# EAGLE design YUJI_VTC (EAGLE 8.0.1)
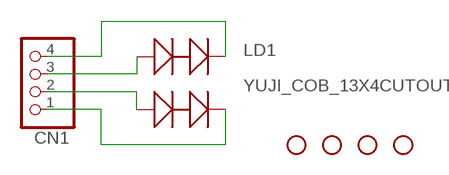
[diagram p0: schematic, sheet 1]

## Parts
CN1  JST_4PIN  [JSTPH4]
LD1  YUJI_COB_13X4CUTOUT  [YUJI_COB_13X4_CUTOUT]
STANDOFF1  STAND-OFF  [STAND-OFF]
STANDOFF2  STAND-OFF  [STAND-OFF]
STANDOFF3  STAND-OFF  [STAND-OFF]
STANDOFF4  STAND-OFF  [STAND-OFF]

## Nets
N$1: CN1.3 LD1.ANODE1
N$2: CN1.4 LD1.CATHODE1
N$3: CN1.1 LD1.CATHODE2
N$4: CN1.2 LD1.ANODE2

## Library data of the parts
CN1 = Yuji_LED:JST_4PIN
LD1 = Yuji_LED:YUJI_COB_13X4
STANDOFF1-STANDOFF4 = Spectron2:STAND-OFF: #4 Stand Off This is the mechanical footprint for a #4 phillips button head screw. Use the keepout ring to avoid running the screw head into surrounding components. SKU : PRT-00447

## Board
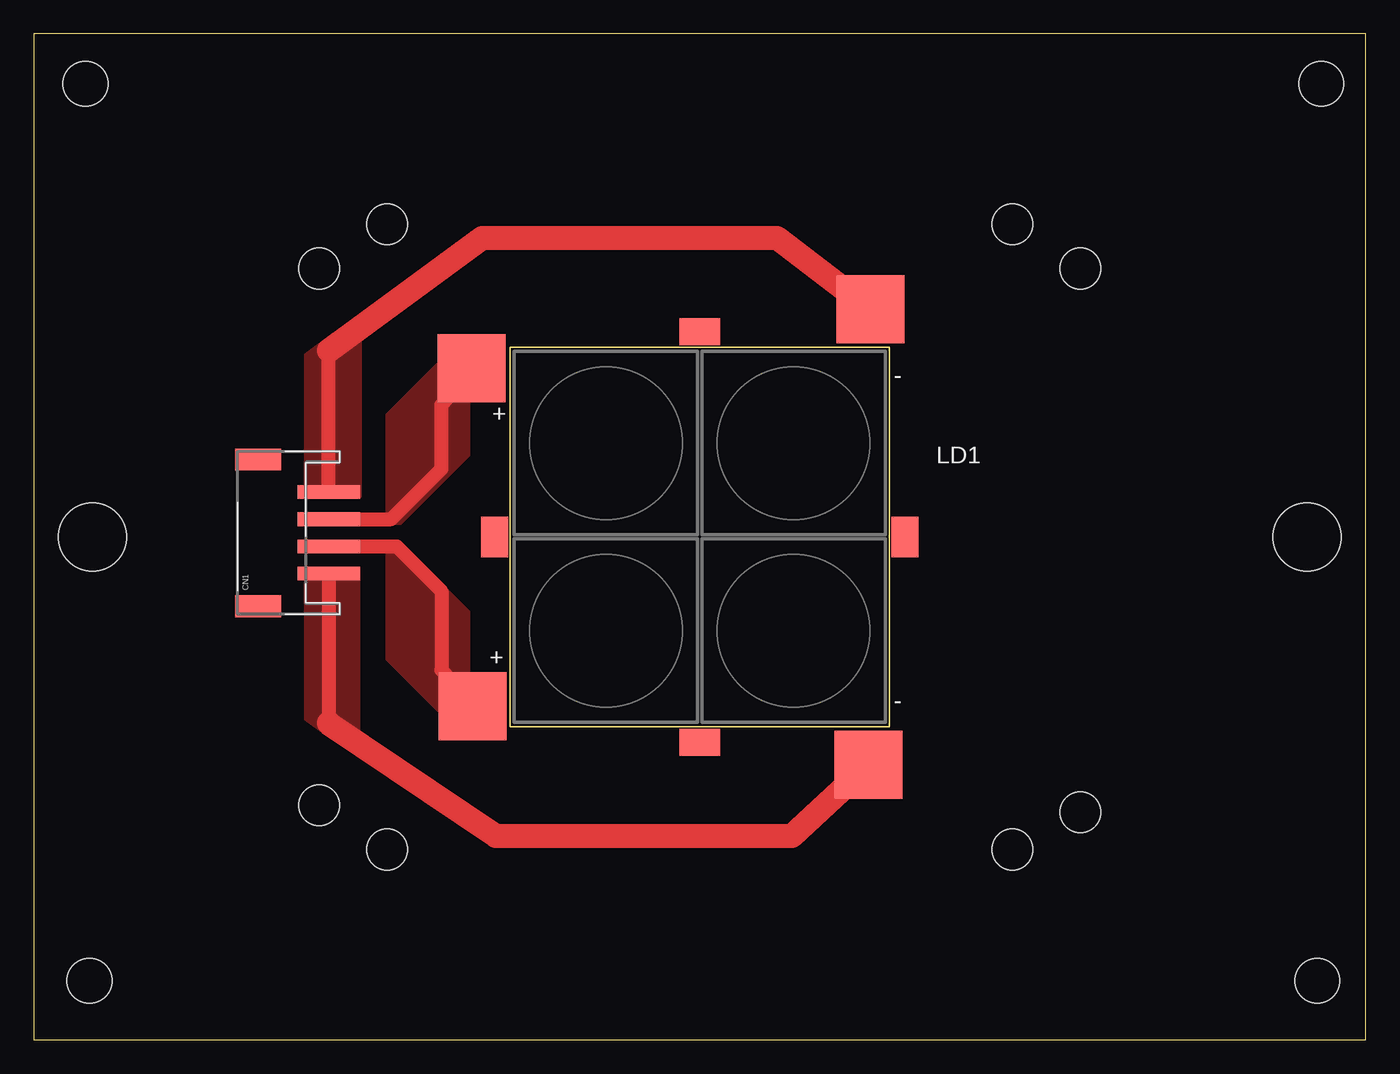
[diagram p1: board, top side]

Size 98 x 74 mm. Coordinates in mm from the lower left corner, seen from the top.
Outline: 0,0 98,0 98,74 0,74 0,0
Copper layers (1*16): Top 0.035559375mm / dielectric 1.6mm / Bottom 0.035559375mm
Design rules "oshpark-2layer": minimum track width 6mil, minimum drill 10mil, track to track 6mil, track to pad 6mil, pad to pad 6mil, via to via 6mil, smd to smd 6mil, copper to edge 15mil, drill to drill 6mil, minimum pad ring 5mil, minimum via ring 5mil, stop-mask expansion 2.5mil, vias tented up to drill 0mil, thermal gap 10mil
Holes 5 mm at 4.3,37 93.7,37
Holes 3 mm at 77,56.75 21,56.75 21,17.25 77,16.75

### Footprints (pad centres in the part's own frame; a part is rotated, then mirrored left to right if it is on the bottom)
JSTPH4 = smd 1 x 4.6: 1 -3,-3.7; 2 -1,-3.7; 3 1,-3.7; 4 3,-3.7 | smd 1.6 x 3.4: NC1 -5.4,1.5; NC2 5.4,1.5
YUJI_COB_13X4_CUTOUT = smd 5 x 5: ANODE1 -16.777,12.412; ANODE2 -16.724,-12.449; CATHODE1 12.571,16.761; CATHODE2 12.417,-16.749 | smd 3 x 2: P$1 0,15.1; P$2 0,-15.1 | smd 2 x 3: P$3 15.1,0; P$4 -15.1,0 | hole 3: -23,23; 23,23; 23,-23; -23,-23
STAND-OFF = hole 3.302: 0,0

### Placement (x,y rotation side)
CN1  18,37.3 90 top
LD1  49,37 0 top
STANDOFF1  3.79,70.34 0 top
STANDOFF2  94.44,4.34 0 top
STANDOFF3  4.09,4.34 0 top
STANDOFF4  94.74,70.34 0 top

### Tracks (layer width: path | path; a pad name or v marks a point on that pad's centre or on a via)
N$1
  Top 1.016: CN1.3 26.3,38.3 30,42 30,46.7 LD1.ANODE1
  pour Top (no thermals): 27,38 32,43 32,50 30,50 26,46 26,38
N$2
  Top 1.016: CN1.4 21.7,50.7
  Top 1.778: 21.7,50.7 33,59 54.68,59 LD1.CATHODE1
  pour Top (no thermals): 20,40 20,50.4 22,51.9 24,51.9 24,40
N$3
  Top 1.016: CN1.1 21.7,23.3
  Top 1.778: 21.7,23.3 34,15 55.78,15 LD1.CATHODE2
  pour Top (no thermals): 20,34 23.9,34 23.9,22.3 21.9,22.2 20,23.6
N$4
  Top 1.016: CN1.2 26.7,36.3 30,33 30,27.22 LD1.ANODE2
  pour Top (no thermals): 26,36.5 27,36.5 32,31.5 32,24 30,24 26,28